# EAGLE design servoventil (EAGLE 9.3.0)
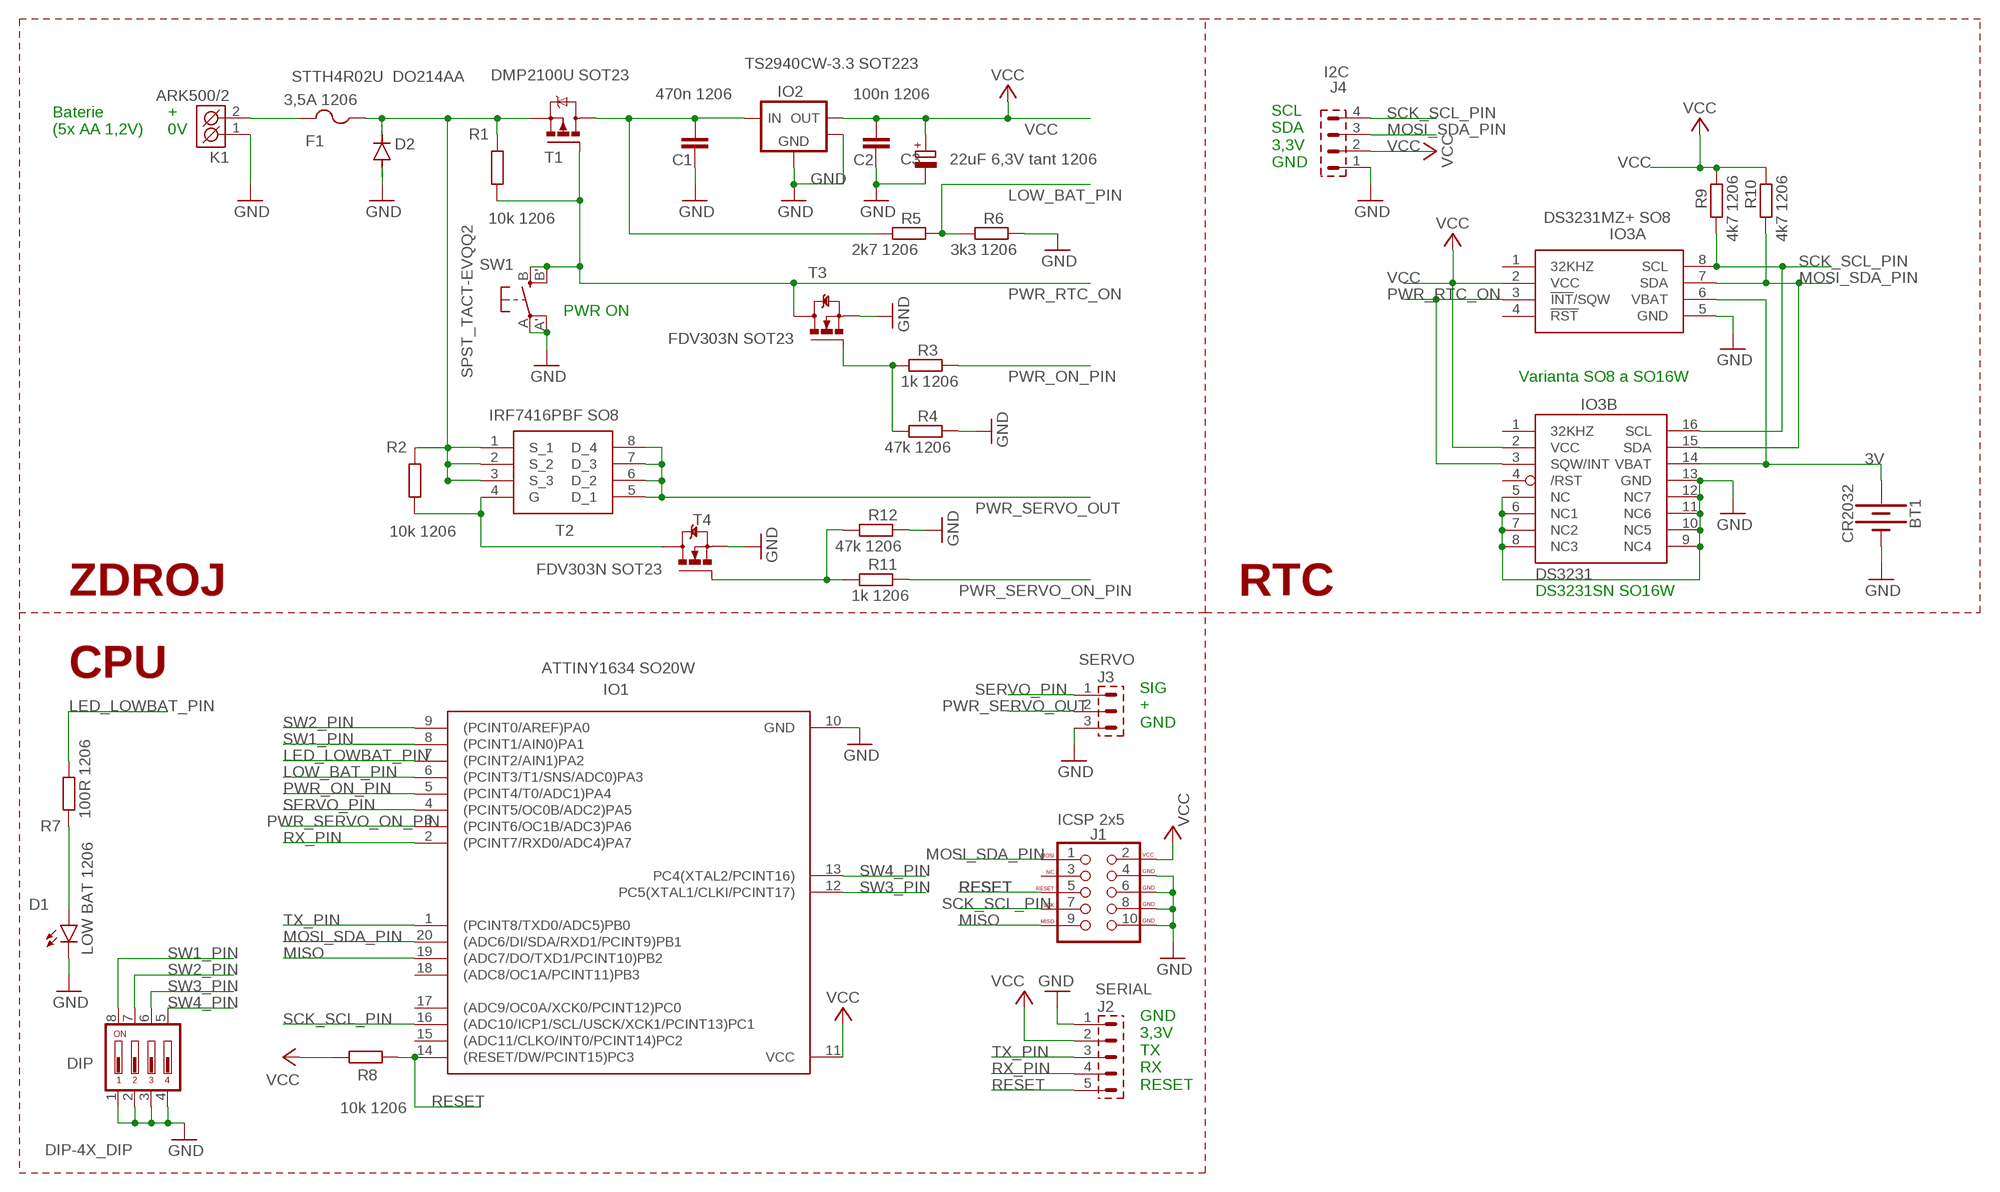
[diagram p0: schematic, sheet 1]

## Parts
BT1  CR2032  BATTERY-20MM_PTH  [BATTCOM_20MM_PTH]
C1  470n 1206  C-EUC1206  [C1206]
C2  100n 1206  C-EUC1206  [C1206]
C3  22uF 6,3V tant 1206  CPOL-EUCT3216  [CT3216]
D1  LOW BAT 1206  LED1206  [LED-1206]
D2  STTH4R02U DO214AA  DIODE-DO214AA  [DO214AA]
DIP  DIP-4X_DIP  [DIP-4X]
F1  3,5A 1206  PTCFUSE-1206  [R1206]
IO1  ATTINY1634 SO20W  ATTINY1634-SU  [SOIC20]
IO2  TS2940CW-3.3 SOT223  MCP1825_SOT223  [SOT-223-3]
IO3A  DS3231MZ+ SO8  DS3231MZ+  [SOIC127P600X175-8N]
IO3B  DS3231SN SO16W  DS3231/SO  [SO16W]
J1  ICSP 2x5  AVR_SPI_PROG_5X2LOCK  [2X5-SHROUDED_LOCK]
J2  SERIAL  S1G5_JUMP  [S1G5_JUM]
J3  SERVO  S1G3_JUMP  [S1G3_JUM]
J4  I2C  S1G4_JUMP  [S1G4_JUM]
K1  ARK500/2  [ARK500/2]
R1  10k 1206  R-EU_R1206  [R1206]
R2  10k 1206  R-EU_R1206  [R1206]
R3  1k 1206  R-EU_R1206  [R1206]
R4  47k 1206  R-EU_R1206  [R1206]
R5  2k7 1206  R-EU_R1206  [R1206]
R6  3k3 1206  R-EU_R1206  [R1206]
R7  100R 1206  R-EU_R1206  [R1206]
R8  10k 1206  R-EU_R1206  [R1206]
R9  4k7 1206  R-EU_R1206  [R1206]
R10  4k7 1206  R-EU_R1206  [R1206]
R11  1k 1206  R-EU_R1206  [R1206]
R12  47k 1206  R-EU_R1206  [R1206]
SW1  SPST_TACT-EVQQ2  [EVQ-Q2]
T1  DMP2100U SOT23  MOSFET-P-SOT23  [SOT-23]
T2  IRF7416PBF SO8  IRF7416PBF  [SOIC127P600X175-8N]
T3  FDV303N SOT23  MOSFET-N-SOT23  [SOT-23]
T4  FDV303N SOT23  MOSFET-N-SOT23  [SOT-23]

## Nets
3V: BT1.1(+) IO3A.6(VBAT) IO3B.14(VBAT)
6V: C1.1 IO2.1(VIN) R5.2 T1.3(D)
GND: BT1.2(-) C1.2 C2.2 C3.- D1.C D2.A DIP.1 DIP.2 DIP.3 DIP.4 IO1.10(GND) IO2.2(GND) IO2.4(HEATSINK) IO3A.5(GND) IO3B.5(NC) IO3B.6(NC1) IO3B.7(NC2) IO3B.8(NC3) IO3B.9(NC4) IO3B.10(NC5) IO3B.11(NC6) IO3B.12(NC7) IO3B.13(GND) J1.4(GND) J1.6(GND) J1.8(GND) J1.10(GND) J2.1 J3.3 J4.1 K1.1(K1) R4.1 R6.1 R12.1 SW1.A'(P1) SW1.A(P) T3.2(S) T4.2(S)
LED_LOWBAT_PIN: IO1.7((PCINT2/AIN1)PA2) R7.1
LOW_BAT_PIN: IO1.6((PCINT3/T1/SNS/ADC0)PA3) R5.1 R6.2
MISO: IO1.19((ADC7/DO/TXD1/PCINT10)PB2) J1.9(MISO)
MOSI_SDA_PIN: IO1.20((ADC6/DI/SDA/RXD1/PCINT9)PB1) IO3A.7(SDA) IO3B.15(SDA) J1.1(MOSI) J4.3 R10.2
N$1: F1.2 K1.2(K2)
N$2: D2.C F1.1 R1.2 R2.2 T1.2(S) T2.1(S_1) T2.2(S_2) T2.3(S_3)
N$3: R3.2 R4.2 T3.1(G)
N$4: R2.1 T2.4(G) T4.3(D)
N$5: R11.2 R12.2 T4.1(G)
N$12: D1.A R7.2
PWR_ON_PIN: IO1.5((PCINT4/T0/ADC1)PA4) R3.1
PWR_RTC_ON: IO3A.3(!INT!/SQW) IO3B.3(SQW/INT) R1.1 SW1.B'(S1) SW1.B(S) T1.1(G) T3.3(D)
PWR_SERVO_ON_PIN: IO1.3((PCINT6/OC1B/ADC3)PA6) R11.1
PWR_SERVO_OUT: J3.2 T2.5(D_1) T2.6(D_2) T2.7(D_3) T2.8(D_4)
RESET: IO1.14((RESET/DW/PCINT15)PC3) J1.5(RESET) J2.5 R8.2
RX_PIN: IO1.2((PCINT7/RXD0/ADC4)PA7) J2.4
SCK_SCL_PIN: IO1.16((ADC10/ICP1/SCL/USCK/XCK1/PCINT13)PC1) IO3A.8(SCL) IO3B.16(SCL) J1.7(SCK) J4.4 R9.2
SERVO_PIN: IO1.4((PCINT5/OC0B/ADC2)PA5) J3.1
SW1_PIN: DIP.8 IO1.8((PCINT1/AIN0)PA1)
SW2_PIN: DIP.7 IO1.9((PCINT0/AREF)PA0)
SW3_PIN: DIP.6 IO1.12(PC5(XTAL1/CLKI/PCINT17))
SW4_PIN: DIP.5 IO1.13(PC4(XTAL2/PCINT16))
TX_PIN: IO1.1((PCINT8/TXD0/ADC5)PB0) J2.3
VCC: C2.1 C3.+ IO1.11(VCC) IO2.3(VOUT) IO3A.2(VCC) IO3B.2(VCC) J1.2(VCC) J2.2 J4.2 R8.1 R9.1 R10.1
Unconnected: IO1.15((ADC11/CLKO/INT0/PCINT14)PC2) IO1.17((ADC9/OC0A/XCK0/PCINT12)PC0) IO1.18((ADC8/OC1A/PCINT11)PB3) IO3A.1(32KHZ) IO3A.4(!RST) IO3B.1(32KHZ) IO3B.4(/RST) J1.3(NC)

## Notes on the sheet
- Baterie 
  (5x AA 1,2V)
- +
  0V
- SCL
  SDA
  3,3V
  GND
- PWR ON
- Varianta SO8 a SO16W
- ZDROJ | RTC | DS3231SN SO16W
- CPU
- SIG
  +
  GND
- GND
  3,3V
  TX
  RX
  RESET

## Library data of the parts
BT1 = SparkFun-Batteries:BATTERY: Battery - Single Cell A variety of battery chemistries, sizes, and footprints. Device List: 20MM_PTH - Coin Cell Battery Holder - 20mm (PTH) <https://www.sparkfun.com/products/783> 20MM_PTH_KIT- Coin Cell battery Holder - 20 mm (PTH) <http://www.sparkfun.com/products/783>kit version with special mask 6.8MM_PTH - Coin Cell Battery Holder - 6.8MM(SMD) <https://www.digikey.com/product-detail/en/seiko-instruments/MS621FE-FL11E/728-1057-ND/1889208?WT.srch=1&gclid=CNOQ5a6LzdQCFZS2wAodXCkE0g> 12MM_SMD - Coin Cell Battery Holder - 12mm (SMD) <https://www.sparkfun.com/products/10592> 12MM_PTH - Coin Cell Battery Holder - 12mm (PTH) <https://www.sparkfun.com/products/7948> 20MM_SMD - 20mm Coin Cell Battery Holder (SMD) (2 legs) Used on the Big Time Watch Kit <https://www.sparkfun.com/products/11734> 20MM_SMD_4LEGS - Coin Cell Battery Holder - 20mm (SMD) <https://www.sparkfun.com/products/11892> 20MM_SMD_4LEGS_OVERPASTE - Coin Cell Battery Holder - 20mm (SMD) <https://www.sparkfun.com/products/11892> (Over-paste on the legs) 24.5MM_PTH - Coin Cell Battery Holder - 24.5mm (PTH) <https://www.sparkfun.com/products/8863> 9V - 9V Battery Holder - PC Mount Used on the SparkFun SparkPunk Sound Kit <https://www.sparkfun.com/products/11177> and SparkFun SparkPunk Sequencer Kit <https://www.sparkfun.com/products/12707> 18650 - Battery Holder - 18650 (PTH) <https://www.sparkfun.com/products/13113> AA - Battery Holder - 1xAA (PTH) <https://www.sparkfun.com/products/7949> AAA - Battery Holder - 1xAAA (PTH) <https://www.sparkfun.com/products/12718> AA_KIT - Battery Holder - 1xAA (PTH) <https://www.sparkfun.com/products/7949> Special kit package - pads only have exposed copper on one side of the board. AAA_KIT - Battery Holder - 1xAAA (PTH) <https://www.sparkfun.com/products/12718> Special kit package - pads only have exposed copper on one side of the board.; PROD_ID: BATT-09031; SF_SKU: PRT-00783
C1 C2 = rcl:C-EU: CAPACITOR, European symbol; SPICEPREFIX: C
C3 = rcl:CPOL-EU: POLARIZED CAPACITOR, European symbol; SPICEPREFIX: C
D1 = SparkFun-LED:LED: LED (Generic) Standard schematic elements and footprints for 5mm, 3mm, 1206, and 0603 sized LEDs. Generic LEDs with no color specified.
D2 = diode:DIODE-: DIODE
DIP = #PaJa_prepinace:DIP-4X: DIP Prepinac - 4x
F1 = adafruit:PTCFUSE: PTC fuses, resettable thermistors
IO1 = bt_avr:ATTINY1634: ATtiny1634 ATtiny1634 is a low-power CMOS 8-bit microcontrollers based on the AVR enhanced RISC architecture. By executing powerful instructions in a single clock cycle, the ATtiny1634 achieves throughputs approaching 1 MIPS per MHz allowing the system designer to optimize power consumption versus processing speed. datasheet_summary.pdf <http://www.atmel.com/Images/Atmel-8303-8-bit-AVR-Microcontroller-tinyAVR-ATtiny1634_Datasheet_summary.pdf>
IO2 = bt_regulator:MCP1825: Microchip MCP1824 LDO Voltage Regulator The MCP1825/MCP1825S is a 500 mA Low Dropout (LDO) linear regulator that provides high current and low output voltages. Datasheet.pdf <http://ww1.microchip.com/downloads/en/DeviceDoc/22056b.pdf>
IO3A = SamacSys_Parts:DS3231MZ+: Real Time Clock 5+/-ppm RTC Source: Datasheet <https://componentsearchengine.com/Datasheets/1/DS3231MZ .pdf>; DESCRIPTION: Real Time Clock 5+/-ppm RTC; HEIGHT: 1.75mm; MANUFACTURER_NAME: Maxim Integrated; MANUFACTURER_PART_NUMBER: DS3231MZ+; MOUSER_PART_NUMBER: 700-DS3231MZ+
IO3B = adafruit:DS3231
J1 = SparkFun-Connectors:AVR_SPI_PROG_5X2: AVR 10-pin ICSP Header This is the standard AVR In Circuit Serial Programming header. Minimal, but includes pin one indicator. Works with standard Olimex programmers. SparkFun Products: 2x5 AVR ICSP Male Header <https://www.sparkfun.com/products/778> - PTH 2x5 Pin Shrouded Header <https://www.sparkfun.com/products/8506> - PTH2; PROD_ID: CONN-08671; SF_ID: PRT-08506
J2 = #PaJa_konektory:S1G5_JUMP: Radove konektory - koliky - 5x
J3 = #PaJa_konektory:S1G3_JUMP: Radove konektory - koliky - 3x
J4 = #PaJa_konektory:S1G4_JUMP: Radove konektory - koliky - 4x
K1 = #PaJa_konektory:ARK500/2: Svorkovnice - roztec 5mm - dvojita
R1-R12 = rcl:R-EU_: RESISTOR, European symbol; SPICEPREFIX: R
SW1 = adafruit:SPST_TACT: SMT 6mm switch, EVQQ2 series http://www.ladyada.net/library/eagle
T1 = bt_transistor:MOSFET-P: P-Channel MOSFET with integrated body diode
T2 = SamacSys_Parts:IRF7416PBF: MOSFET P-Channel 30V 10A HEXFET SOIC8 Infineon IRF7416PBF P-channel MOSFET Transistor, 10 A, 30 V, 8-Pin SOIC Source: Datasheet <https://componentsearchengine.com/Datasheets/1/IRF7416PBF.pdf>; DESCRIPTION: MOSFET P-Channel 30V 10A HEXFET SOIC8 Infineon IRF7416PBF P-channel MOSFET Transistor, 10 A, 30 V, 8-Pin SOIC; HEIGHT: 1.75mm; MANUFACTURER_NAME: Infineon; MANUFACTURER_PART_NUMBER: IRF7416PBF; MOUSER_PART_NUMBER: 942-IRF7416PBF
T3 T4 = bt_transistor:MOSFET-N: N-Channel MOSFET

## Board
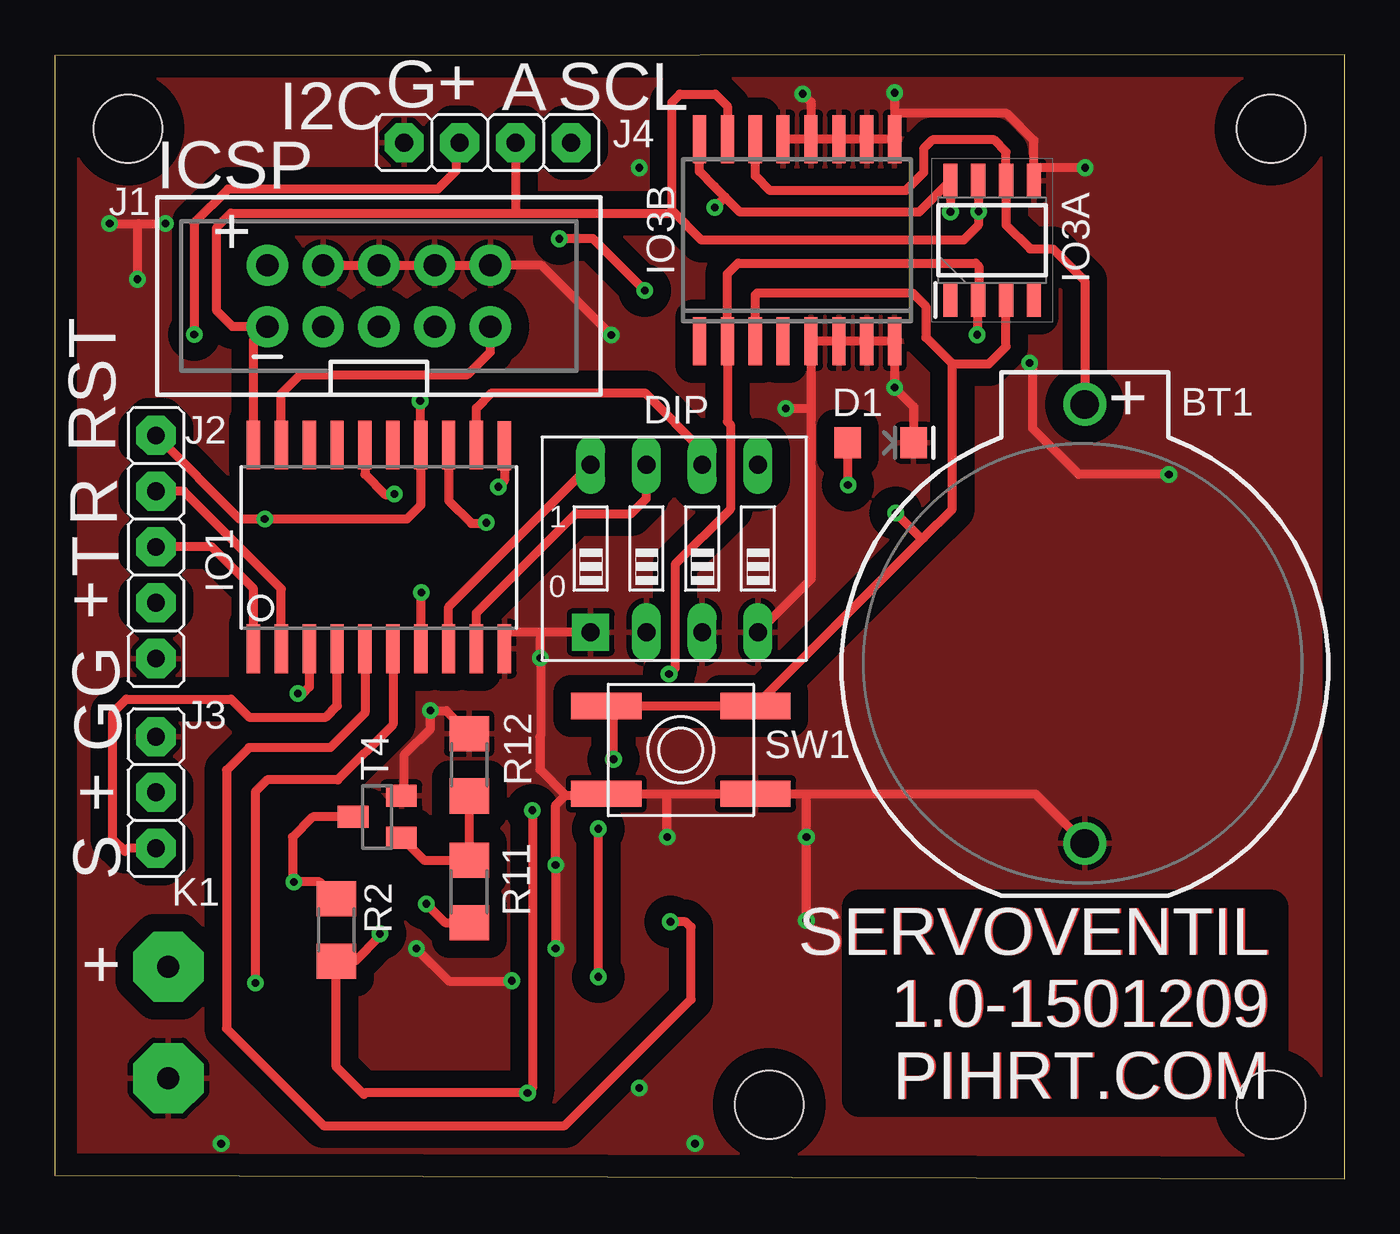
[diagram p1: board, top side]
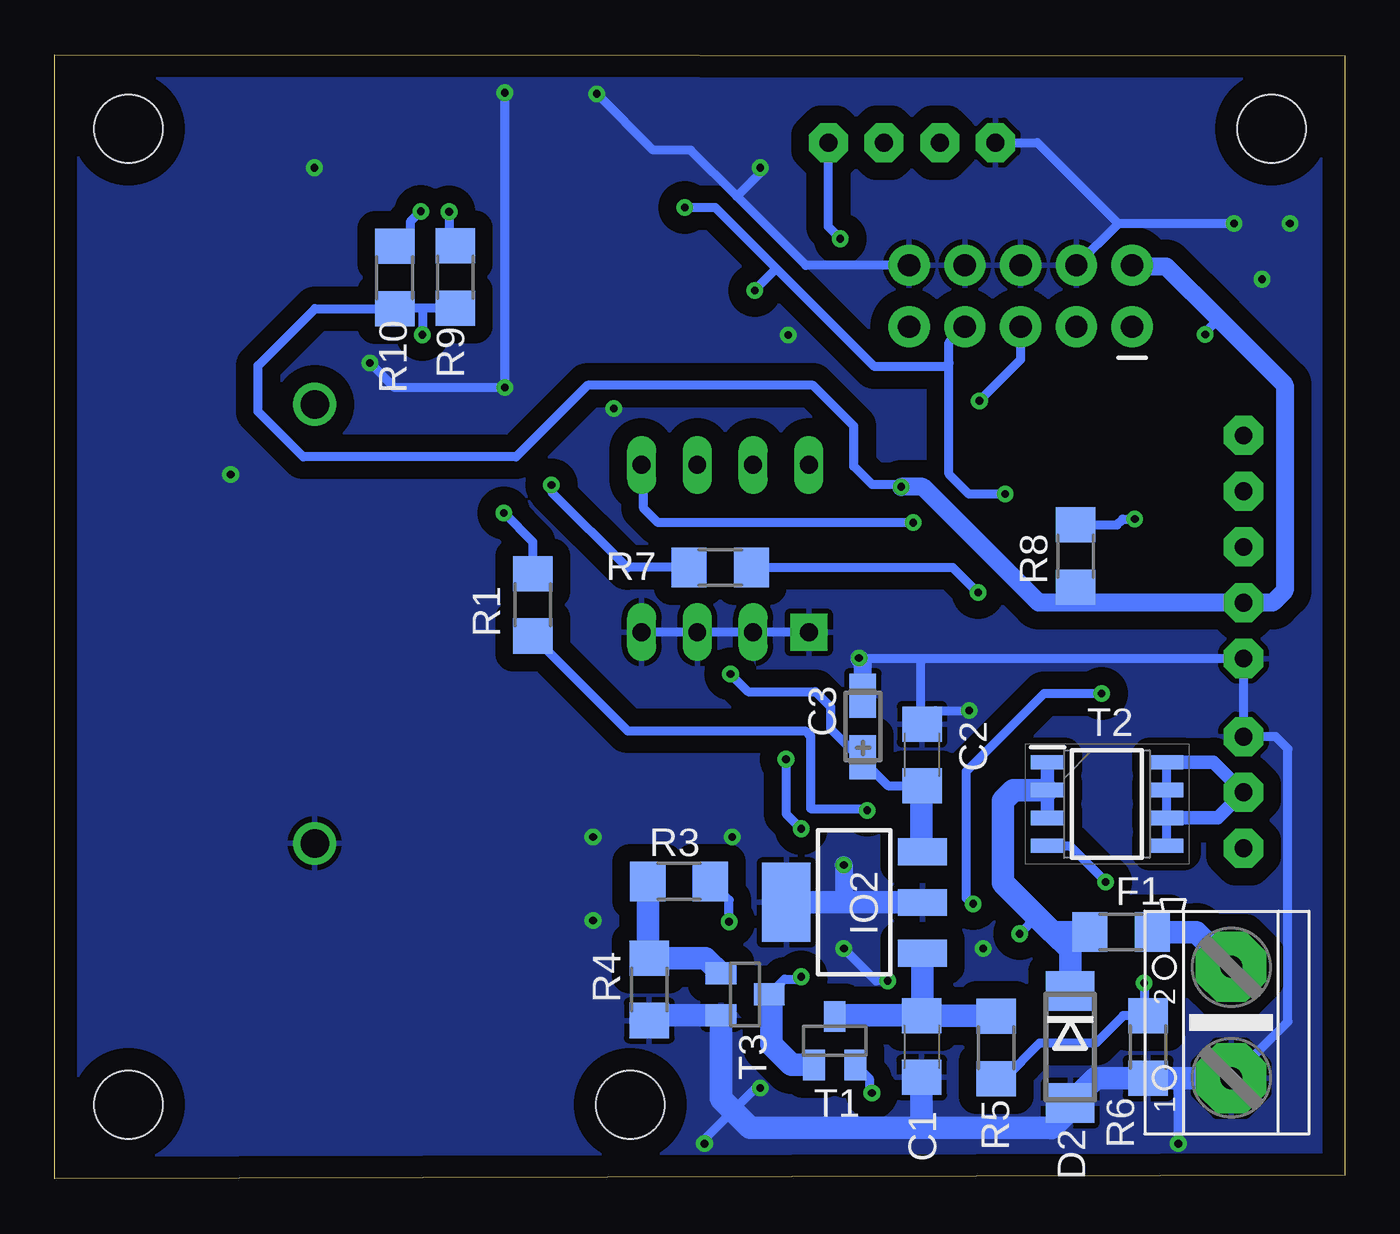
[diagram p2: board, bottom side, seen from below]

Size 58.76 x 51.19 mm. Coordinates in mm from the lower left corner, seen from the top.
Outline: 0,0.15 58.76,0 58.76,51.19 0,51.16 0,0.15
Copper layers (1*16): Top 0.035mm / dielectric 1.5mm / Bottom 0.035mm
Design rules "default": minimum track width 6mil, minimum drill 0.35mm, track to track 6mil, track to pad 6mil, pad to pad 6mil, via to via 6mil, smd to smd 6mil, copper to edge 40mil, drill to drill 6mil, minimum pad ring 10mil, minimum via ring 8mil, stop-mask expansion 4mil, vias tented up to drill 0mil, thermal gap 10mil
Holes 3.1 mm at 3.34,47.83 55.41,47.83 55.41,3.38 32.55,3.38

### Footprints (pad centres in the part's own frame; a part is rotated, then mirrored left to right if it is on the bottom)
BATTCOM_20MM_PTH = drill 1.3: 1 11.85,0; 2 -8.15,0
C1206 = smd 1.6 x 1.8: 1 -1.4,0; 2 1.4,0
CT3216 = smd 2 x 1.2: + -1.4,0; - 1.4,0
LED-1206 = smd 1.2 x 1.4: A -1.5,0; C 1.5,0
DO214AA = smd 1.8 x 2.2: A 2.55,0; C -2.55,0
DIP-4X = drill 0.813 pad 1.676 square: 1 -3.81,-3.81 | drill 0.813 pad 1.27 long: 2 -1.27,-3.81; 3 1.27,-3.81; 4 3.81,-3.81; 5 3.81,3.81; 6 1.27,3.81; 7 -1.27,3.81; 8 -3.81,3.81
R1206 = smd 1.6 x 1.803: 1 -1.422,0; 2 1.422,0
SOIC20 = smd 0.61 x 2.21: 1 -5.715,-4.636; 2 -4.445,-4.636; 3 -3.175,-4.636; 4 -1.905,-4.636; 5 -0.635,-4.636; 6 0.635,-4.636; 7 1.905,-4.636; 8 3.175,-4.636; 9 4.445,-4.636; 10 5.715,-4.636; 11 5.715,4.61; 12 4.445,4.636; 13 3.175,4.636; 14 1.905,4.636; 15 0.635,4.636; 16 -0.635,4.636; 17 -1.905,4.636; 18 -3.175,4.636; 19 -4.445,4.636; 20 -5.715,4.636
SOT-223-3 = smd 1.219 x 2.235: 1 -2.311,-3.099; 2 0,-3.099; 3 2.311,-3.099 | smd 3.6 x 2.2: 4 0,3.099
SOIC127P600X175-8N = smd 1.525 x 0.65: 1 -2.712,1.905; 2 -2.712,0.635; 3 -2.712,-0.635; 4 -2.712,-1.905; 5 2.712,-1.905; 6 2.712,-0.635; 7 2.712,0.635; 8 2.712,1.905
SO16W = smd 0.6 x 2.2: 1 -4.445,-4.6; 2 -3.175,-4.6; 3 -1.905,-4.6; 4 -0.635,-4.6; 5 0.635,-4.6; 6 1.905,-4.6; 7 3.175,-4.6; 8 4.445,-4.6; 9 4.445,4.6; 10 3.175,4.6; 11 1.905,4.6; 12 0.635,4.6; 13 -0.635,4.6; 14 -1.905,4.6; 15 -3.175,4.6; 16 -4.445,4.6
2X5-SHROUDED_LOCK = drill 1.016 pad 1.88: 1 -1.397,5.08; 2 1.397,5.08; 3 -1.397,2.54; 4 1.397,2.54; 5 -1.397,0; 6 1.397,0; 7 -1.397,-2.54; 8 1.397,-2.54; 9 -1.397,-5.08; 10 1.397,-5.08
S1G5_JUM = drill 0.813 pad 1.778 octagon: 1 -5.08,0; 2 -2.54,0; 3 0,0; 4 2.54,0; 5 5.08,0
S1G3_JUM = drill 0.813 pad 1.778 octagon: 1 -2.54,0; 2 0,0; 3 2.54,0
S1G4_JUM = drill 0.813 pad 1.778 octagon: 1 -3.81,0; 2 -1.27,0; 3 1.27,0; 4 3.81,0
ARK500/2 = drill 1 pad 3.2 octagon: 1 -2.54,0; 2 2.54,0
EVQ-Q2 = smd 3.2 x 1.2: A -3.4,-2; A' 3.4,-2; B -3.4,2; B' 3.4,2
SOT-23 = smd 1 x 1.4: 1 -0.95,-1.1; 2 0.95,-1.1; 3 0,1.1

### Placement (x,y rotation side)
BT1  46.93,23.42 90 top
C1  19.27,6.02 270 bottom
C2  19.25,19.3 90 bottom
C3  21.95,20.6 90 bottom
D1  37.62,33.52 0 top
D2  12.5,6 270 bottom
DIP  28.22,28.71 0 top
F1  10.18,11.24 0 bottom
IO1  14.77,28.78 0 top
IO2  22.34,12.59 90 bottom
IO3A  42.71,42.75 90 top
IO3B  33.82,42.75 0 top
J1  14.77,40.21 90 top
J2  4.61,28.78 90 top
J3  4.61,17.6 90 top
J4  19.71,47.19 0 top
K1  5.17,7.12 90 bottom
R1  36.99,26.14 270 bottom
R2  12.82,11.33 270 top
R3  30.33,13.55 180 bottom
R4  31.68,8.63 90 bottom
R5  15.87,5.98 90 bottom
R6  8.96,6.01 90 bottom
R7  28.46,27.84 180 bottom
R8  12.26,28.36 90 bottom
R9  40.52,41.07 90 bottom
R10  43.28,41.05 90 bottom
R11  18.88,13.09 90 top
R12  18.88,18.86 270 top
SW1  28.52,19.53 0 top
T1  23.23,6.29 0 bottom
T2  10.83,17.07 0 bottom
T3  27.31,8.4 270 bottom
T4  14.69,16.49 90 top

### Tracks (layer width: path | path; a pad name or v marks a point on that pad's centre or on a via)
3V
  Top 0.406: IO3B.14 31.91,45.68 32.59,45.01 38.75,45.01 39.58,45.83 39.58,46.9 39.99,47.32 42.8,47.32 43.34,46.77 IO3A.6 43.34,43.45 44.44,42.35 45.47,42.35 46.93,40.89 BT1.1
6V
  Bottom 1.016: IO2.1 19.24,7.45 | 19.24,7.45 C1.1 15.89,7.42 R5.2 | T1.3 23.17,7.45 19.24,7.45
GND  (via drill 0.35)
  Top 0.406: DIP.1 22.27,24.9 | 22.27,24.9 20.44,24.9 20.44,24.89 20.48,24.84 IO1.10 | J1.4 J1.6 J1.8 J1.10 22.18,41.6 v25.36,38.43 | 34.45,35.09 IO3B.5 IO3B.6 IO3B.7 IO3B.8 38.26,36.24 v38.26,36.03 39.12,35.17 D1.C | 34.45,35.09 34.45,27.31 DIP.4 | IO3B.9 IO3B.10 IO3B.11 IO3B.12 | IO3B.12 IO3B.13 | v38.26,49.47 38.26,48.53 | 38.26,48.53 IO3B.9 | IO3B.9 | IO3A.5 44.61,46 | 44.61,46 44.61,47.28 43.37,48.53 38.26,48.53 | v34.07,49.42 34.45,49.04 IO3B.12 | 22.27,24.9 22.12,24.75 v22.12,23.72 22.12,20.15 22.1,20.12 22.1,18.64 23.27,17.47 | 27.92,17.53 SW1.A 25.06,17.47 23.27,17.47 | 27.92,17.53 SW1.A' 34.28,17.53 | 34.28,17.53 44.67,17.53 BT1.2 | T4.2 15.92,17.56 15.92,19.31 17.11,20.5 v17.11,21.32 17.83,21.32 R12.1 | v22.82,10.49 v22.82,14.3 22.82,17.01 23.27,17.47 | v34.25,11.76 v34.25,15.57 34.25,17.5 34.28,17.53 | v50.76,32.08 46.65,32.08 44.56,34.17 44.56,37 v44.41,37.16 | v33.3,35.09 34.45,35.09 | v2.5,43.51 3.82,43.51 | 3.82,43.51 v5.04,43.51 | v3.77,40.97 3.77,43.45 3.82,43.51 | v46.95,46.05 44.66,46.05 44.61,46 | v27.9,15.57 27.9,17.51 27.92,17.53 | v16.47,10.49 17.95,9 20.74,9 20.76,9.02 v20.82,9.02
  Bottom 0.406: v38.26,49.47 v38.26,36.03 43.28,36.03 v44.41,37.16 | J1.10 24.55,41.6 27.69,44.75 | 27.69,44.75 29.79,46.85 31.5,46.85 v34.07,49.42 | J3.3 J2.1 19.31,23.7 | J3.3 | 19.31,23.7 22.11,23.7 22.12,23.68 | 22.16,23.65 22.12,23.68 | 22.12,23.68 v22.12,23.72 | K1.1 2.59,7.16 2.59,19.58 3.15,20.14 J3.3 | 19.31,23.7 19.31,20.76 C2.2 18.63,21.32 v17.11,21.32 | DIP.1 DIP.2 DIP.3 DIP.4 | v5.04,43.51 10.32,43.51 | 10.32,43.51 J1.4 | v29.17,1.6 29.17,1.79 27.86,3.1 26.82,4.14 v26.63,4.14 | v26.63,46.05 26.63,45.82 27.69,44.75 | v7.58,1.6 7.58,4.52 7.63,4.58 | v20.82,9.02 21.34,9.02 v22.82,10.49 | J4.1 14,47.19 10.32,43.51
  Bottom 0.813: v22.82,14.3 22.82,12.62 22.84,12.59 | C3.- 21.95,23.54 22.11,23.7
  Bottom 1.016: K1.1 7.63,4.58 8.94,4.58 R6.1 11.37,4.59 D2.A 12.5,3.16 13.37,2.3 13.39,2.32 18.89,2.32 | C1.2 19.27,2.71 18.89,2.32 | R4.1 31.44,7.45 T3.2 28.41,3.65 27.86,3.1 27.09,2.32 18.89,2.32 | IO2.2 22.84,12.59 IO2.4
  pour Bottom (isolate 0.813): -0.47,51.64 59.22,51.64 59.22,-0.43 -0.47,-0.43
  pour Top (isolate 0.813): -0.47,51.64 59.22,51.64 59.22,-0.43 -0.47,-0.43
LED_LOWBAT_PIN  (via drill 0.35)
  Top 0.406: v16.69,26.7 16.67,26.68 IO1.7
  Bottom 0.406: R7.1 17.86,27.84 16.78,26.76 16.72,26.76 16.72,26.73 v16.69,26.7
LOW_BAT_PIN  (via drill 0.35)
  Top 0.406: v9.13,8.92 v9.13,8.93 9.13,17.62 9.68,18.17 12.89,18.17 15.4,20.68 IO1.6
  Bottom 0.406: R5.1 15.51,4.56 13.9,6.18 11.34,6.18 10.09,7.43 R6.2 9.13,7.61 v9.13,8.92
MISO
  Top 0.406: IO1.19 10.32,35.76 11.18,36.62 18.8,36.62 19.85,37.67 J1.9
MOSI_SDA_PIN  (via drill 0.35)
  Top 0.406: IO1.20 9.05,38.17 J1.1 8.09,38.81 7.37,39.53 7.37,43.34 8.02,43.98 21.05,43.98 | v42.09,44.06 42.07,44.08 42.07,44.17 IO3A.7 42.07,43.43 41.39,42.76 29.47,42.76 28.11,44.12 | 28.11,44.12 28.11,49.03 28.48,49.4 30.09,49.4 30.64,48.85 IO3B.15 | 21.05,43.98 27.97,43.98 28.11,44.12 | J4.3 20.98,44.04 21.05,43.98
  Bottom 0.406: v42.09,44.06 42.57,43.58 42.57,43.03 43.13,42.48 R10.2
N$1
  Bottom 1.016: F1.2 6.75,11.24 K1.2
N$2  (via drill 0.35)
  Top 0.406: v14.8,11.16 14.83,11.14 14.83,11.06 13.67,9.91 R2.2 12.82,5.1 14.08,3.85 14.14,3.91 v21.53,3.91 21.76,4.13 v21.76,16.78
  Bottom 0.406: v14.8,11.16 14.08,11.88 14.08,12 | T1.2 21.65,4.56 21.65,4.03 v21.53,3.91 | R1.2 32.66,20.4 24.57,20.4 24.34,20.16 24.34,16.86 21.83,16.86 v21.76,16.78 | 12.5,10.42 12.5,10.34
  Bottom 0.61: T2.1 T2.2 T2.3
  Bottom 1.016: 12.5,10.34 D2.C | T2.2 15.09,17.71 15.57,17.23 15.57,13.49 14.08,12 13.32,11.24 | 13.32,11.24 12.5,10.42 | F1.1 13.32,11.24
N$3
  Bottom 1.016: T3.1 29.11,10.05 R4.2 31.75,10.12 R3.2
N$4  (via drill 0.35)
  Top 0.406: R2.1 12.06,13.52 v10.88,13.52 10.83,13.57 10.83,15.56 11.75,16.49 T4.3
  Bottom 0.406: T2.4 12.53,15.17 v10.88,13.52
N$5
  Top 0.406: T4.1 16.82,14.51 R11.2 R12.2
N$12  (via drill 0.35)
  Top 0.406: v36.14,31.6 36.14,33.51 D1.A
  Bottom 0.406: R7.2 32.66,27.84 32.68,27.82 36.1,31.24 36.1,31.46 36.14,31.49 v36.14,31.6
PWR_ON_PIN  (via drill 0.35)
  Top 0.406: IO1.5 14.13,21.22 12.55,19.64 8.85,19.64 7.82,18.61 7.82,6.84 12.24,2.42 23.23,2.42 28.98,8.18 28.98,11.47 28.74,11.71 v28.05,11.71
  Bottom 0.406: v28.05,11.71 28.05,12.69 R3.1
PWR_RTC_ON  (via drill 0.35)
  Top 0.406: IO3B.3 31.91,40.26 32,40.35 39.07,40.35 39.68,39.73 39.68,38.32 40.89,37.12 | 40.89,37.12 42.55,37.12 43.34,37.9 IO3A.3 | SW1.B 25.44,21.53 | 25.44,21.53 SW1.B' 39.57,29.19 | 39.57,29.19 40.89,30.5 40.89,37.12 | v38.31,30.32 39.45,29.19 39.57,29.19 | v24.76,9.2 v24.76,15.94 | v25.45,19.11 25.45,21.52 25.44,21.53
  Bottom 0.406: R1.1 36.99,29 v38.31,30.32 | v38.31,30.32 | T3.3 25.52,9.09 24.94,9.09 24.83,9.2 v24.76,9.2 | v24.76,15.94 25.45,16.63 v25.45,19.1 v25.45,19.11
  Bottom 1.016: T3.3 26.12,8.31 26.12,6.11 25.19,5.19 T1.1
PWR_SERVO_ON_PIN  (via drill 0.35)
  Top 0.406: IO1.3 11.59,22.4 11.29,22.1 v11.08,22.1 | v16.92,12.52 17.78,11.67 R11.1
  Bottom 0.406: v11.08,22.1 13.7,22.1 17.25,18.55 17.25,12.79 16.98,12.52 v16.92,12.52
PWR_SERVO_OUT
  Bottom 0.406: T2.8 T2.7 T2.6 T2.5
  Bottom 0.61: T2.8 5.98,18.98 J3.2 5.77,16.44 T2.6
RESET  (via drill 0.35)
  Top 0.406: J2.5 8.42,30.05 v9.56,30.05 16.04,30.05 16.67,30.68 IO1.14 16.67,35.4 v16.64,35.43
  Bottom 0.406: v16.64,35.43 14.77,37.31 J1.5 | R8.2 10.37,29.78 10.11,30.05 v9.56,30.05
RX_PIN
  Top 0.406: IO1.2 10.32,26.87 5.88,31.32 J2.4
SCK_SCL_PIN  (via drill 0.35)
  Top 0.406: IO1.16 14.13,32.09 15.05,31.16 15.45,31.16 v15.47,31.18 | v40.8,44.05 40.78,44.06 40.78,44.13 40.8,44.15 IO3A.8 39.37,44.03 31.22,44.03 30.54,44.71 | IO3B.16 29.37,45.88 30.06,45.19 30.54,44.71 | v30.06,44.24 30.54,44.71 | v26.88,40.45 24.52,42.82 v22.98,42.82
  Bottom 0.406: v15.47,31.18 17.12,31.18 18.02,32.09 18.02,37.16 | 18.02,37.16 18.02,38.09 J1.7 | v40.8,44.05 40.8,42.78 R9.2 | 18.02,37.16 18.2,36.98 21.42,36.98 25.93,41.5 | 25.93,41.5 28.67,44.24 v30.06,44.24 | 25.93,41.5 25.93,41.42 26.88,40.48 v26.88,40.45 | v22.98,42.82 23.52,43.36 J4.4
SERVO_PIN
  Top 0.406: J3.1 3.35,15.06 3.2,14.91 2.64,15.47 2.64,21.23 3.25,21.84 8.03,21.84 8.85,21.03 12.35,21.03 12.86,21.54 IO1.4
SW1_PIN
  Top 0.406: IO1.8 17.94,26.04 DIP.8
SW2_PIN
  Top 0.406: IO1.9 19.21,25.78 23.73,30.3 26.26,30.3 26.95,30.99 DIP.7
SW3_PIN
  Top 0.406: IO1.12 19.21,35.11 19.9,35.8 26.88,35.8 29.59,33.09 29.49,33 DIP.6
SW4_PIN  (via drill 0.35)
  Top 0.406: IO1.13 17.94,30.89 18.98,29.85 19.63,29.85 v19.66,29.88
  Bottom 0.406: v19.66,29.88 31.28,29.88 31.93,30.54 31.93,32.42 DIP.5
TX_PIN
  Top 0.406: IO1.1 9.05,26.87 7.15,28.78 J2.3
VCC  (via drill 0.35)
  Top 0.406: IO1.11 20.48,31.8 v20.2,31.52 | J4.2 18.27,47.01 18.27,45.91 17.44,45.08 7.89,45.08 6.35,43.54 v6.35,38.45 | v42.02,38.44 42.04,38.46 42.04,40 IO3A.2 42.09,40.06 42.09,41.56 41.94,41.71 31.13,41.71 30.64,41.22 IO3B.2 30.64,34.49 30.78,34.35 30.78,30.5 28.27,27.98 28.27,23.27 v27.98,22.99
  Bottom 0.406: v6.35,38.45 6.35,38.55 5.74,39.16 | R9.1 42.02,39.65 | 42.02,39.65 43.26,39.65 R10.1 46.92,39.63 49.51,37.04 49.51,34.94 47.45,32.88 37.76,32.88 34.49,36.14 24.21,36.14 22.36,34.28 22.36,32.45 21.52,31.61 20.29,31.61 v20.2,31.52 | v27.98,22.99 27.18,22.19 24.11,22.19 23.42,21.49 23.42,20.5 22.17,19.25 20.82,17.91 C2.1 | 42.02,39.65 v42.02,38.45 v42.02,38.44
  Bottom 0.813: J1.2 9.64,41.56 8.14,41.56 5.74,39.16 2.73,36.15 2.73,26.79 3.28,26.24 J2.2 12.21,26.24 | 12.21,26.24 13.94,26.24 19.22,31.52 v20.2,31.52 | R8.1 12.21,26.88 12.21,26.24 | C3.+ 22,19.25 22.17,19.25
  Bottom 1.016: IO2.3 19.28,14.94 19.28,17.87 C2.1

### Text on the board
Top: SERVOVENTIL / 1.0-1501209 / PIHRT.COM
tNames: G | + | I2C | A | SCL | ICSP | + | + | RST | R | T | + | G | G | + | S | + | SERVOVENTIL / 1.0-1501209 / PIHRT.COM